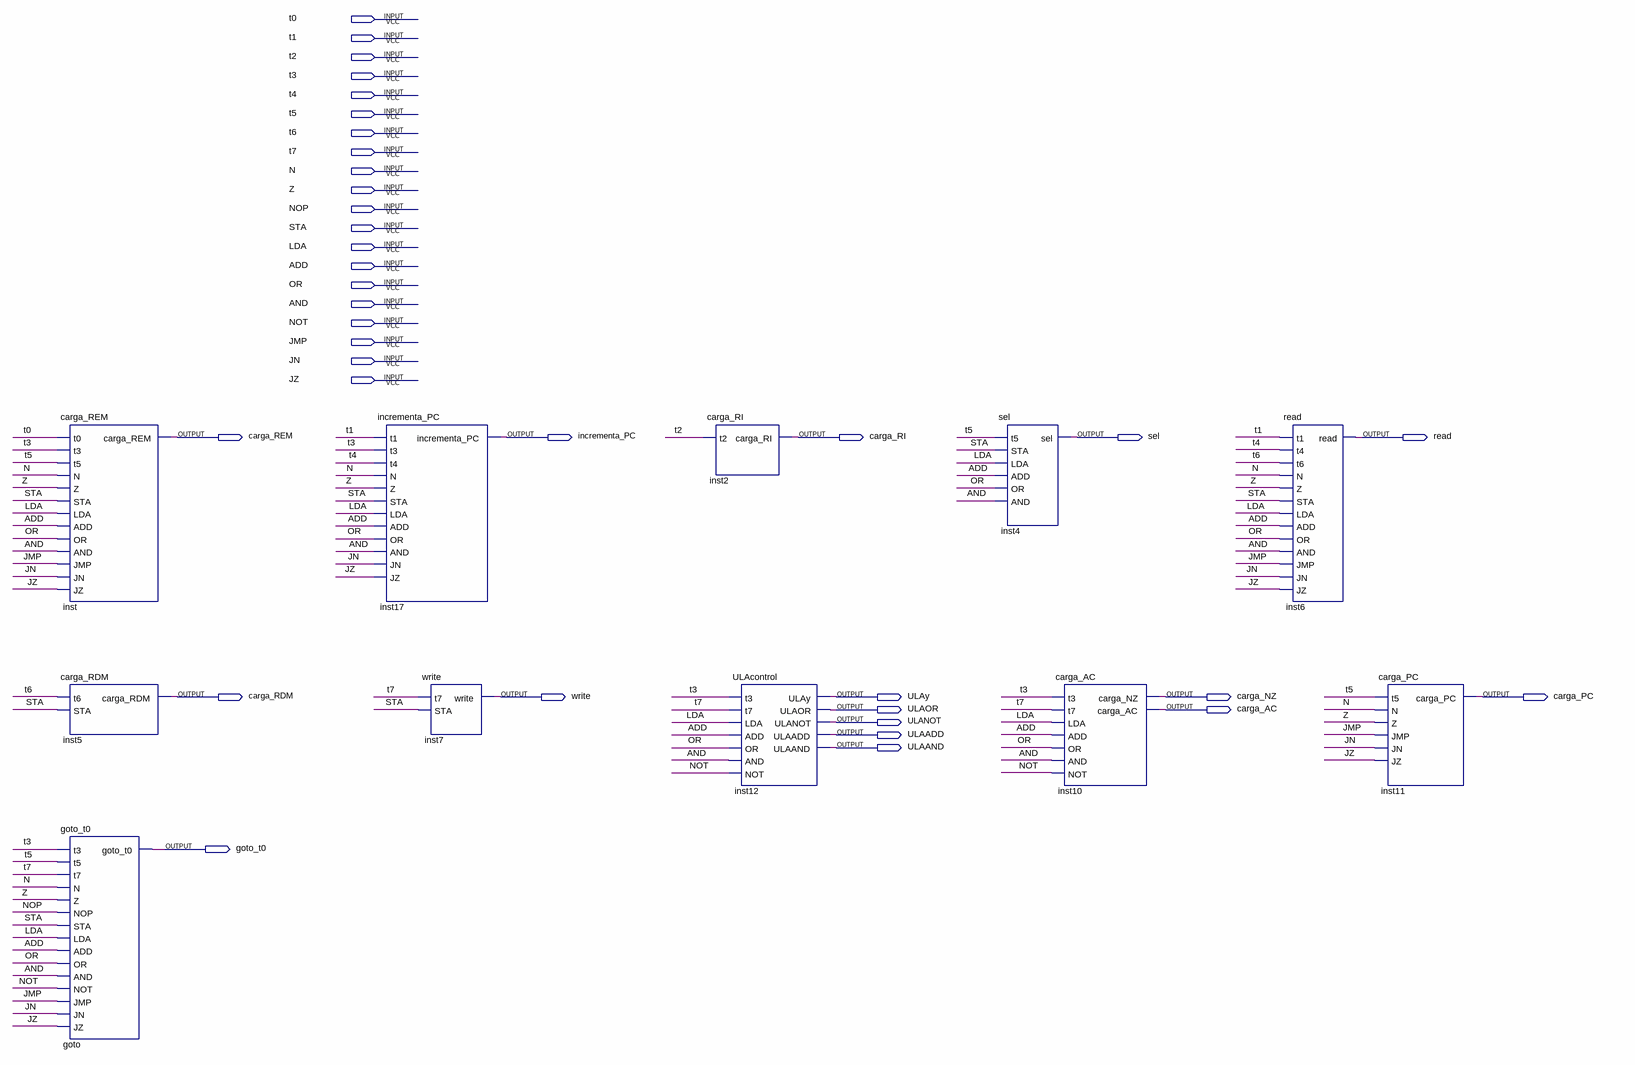
[diagram p0: schematic sheet]
// Quartus schematic UnidadeControle.bdf as structural Verilog: 11 symbols, 36 pins
module UnidadeControle (
  input  t0,
  input  t1,
  input  t2,
  input  t3,
  input  t4,
  input  t5,
  input  t6,
  input  t7,
  input  N,
  input  Z,
  input  NOP,
  input  STA,
  input  LDA,
  input  ADD,
  input  OR,
  input  AND,
  input  NOT,
  input  JMP,
  input  JN,
  input  JZ,
  output carga_REM,
  output incrementa_PC,
  output carga_RI,
  output sel,
  output read,
  output carga_RDM,
  output write,
  output ULAy,
  output carga_NZ,
  output carga_PC,
  output ULAOR,
  output carga_AC,
  output ULANOT,
  output ULAADD,
  output ULAAND,
  output goto_t0
);

  carga_REM inst (
    .t0(t0), .t3(t3), .t5(t5), .N(N), .Z(Z), .STA(STA), .LDA(LDA), .ADD(ADD), .OR(OR), .AND(AND), .JMP(JMP),
    .JN(JN), .JZ(JZ), .carga_REM(carga_REM));
  carga_RDM inst5 (.t6(t6), .STA(STA), .carga_RDM(carga_RDM));
  goto_t0 goto (
    .t3(t3), .t5(t5), .t7(t7), .N(N), .Z(Z), .NOP(NOP), .STA(STA), .LDA(LDA), .ADD(ADD), .OR(OR), .AND(AND),
    .NOT(NOT), .JMP(JMP), .JN(JN), .JZ(JZ), .goto_t0(goto_t0));
  incrementa_PC inst17 (
    .t1(t1), .t3(t3), .t4(t4), .N(N), .Z(Z), .STA(STA), .LDA(LDA), .ADD(ADD), .OR(OR), .AND(AND), .JN(JN),
    .JZ(JZ), .incrementa_PC(incrementa_PC));
  write inst7 (.t7(t7), .STA(STA), .write(write));
  carga_RI inst2 (.t2(t2), .carga_RI(carga_RI));
  ULAcontrol inst12 (
    .t3(t3), .t7(t7), .LDA(LDA), .ADD(ADD), .OR(OR), .AND(AND), .NOT(NOT), .ULAy(ULAy), .ULAOR(ULAOR),
    .ULANOT(ULANOT), .ULAADD(ULAADD), .ULAAND(ULAAND));
  sel inst4 (.t5(t5), .STA(STA), .LDA(LDA), .ADD(ADD), .OR(OR), .AND(AND), .sel(sel));
  carga_AC inst10 (
    .t3(t3), .t7(t7), .LDA(LDA), .ADD(ADD), .OR(OR), .AND(AND), .NOT(NOT), .carga_NZ(carga_NZ),
    .carga_AC(carga_AC));
  read inst6 (
    .t1(t1), .t4(t4), .t6(t6), .N(N), .Z(Z), .STA(STA), .LDA(LDA), .ADD(ADD), .OR(OR), .AND(AND), .JMP(JMP),
    .JN(JN), .JZ(JZ), .read(read));
  carga_PC inst11 (.t5(t5), .N(N), .Z(Z), .JMP(JMP), .JN(JN), .JZ(JZ), .carga_PC(carga_PC));
endmodule
